# Altium schematic sheet AFE.SchDoc: Plant - AFE
size A4; Author: Carlos de la Fuente; CompanyName: ekuore; DrawnBy: Carlos de la Fuente; Engineer: Carlos de la Fuente; Organization: eKuore; Revision: 0.2; SheetNumber: 4; SheetTotal: 5
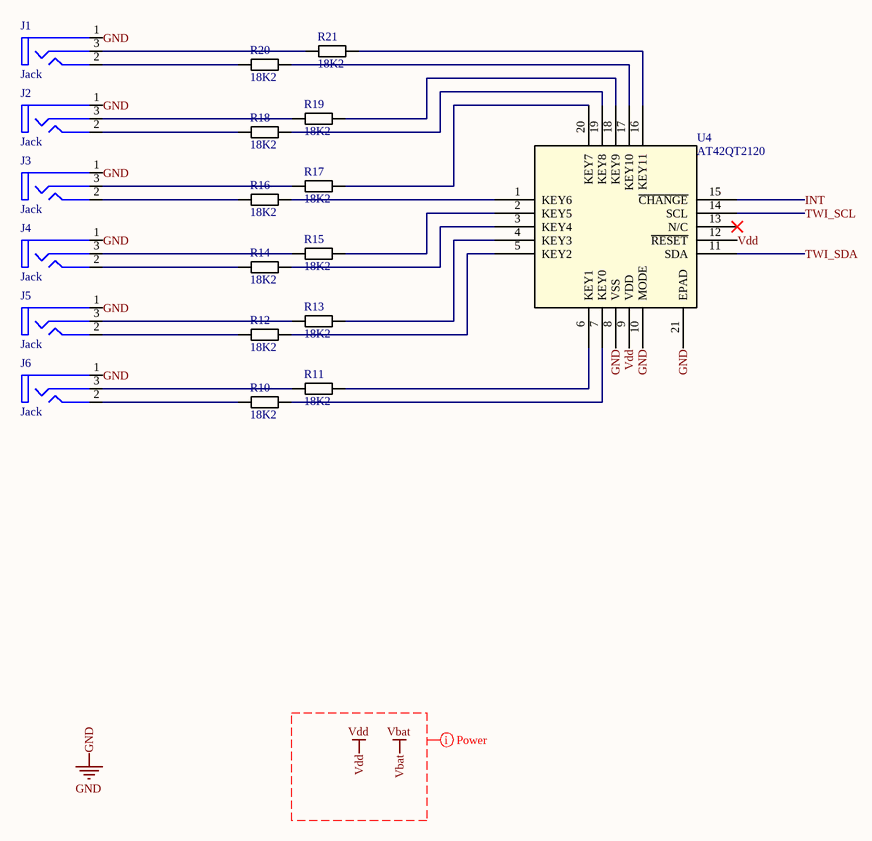
[diagram p0: AFE.SchDoc]

## Parts
J1  Jack  [CUI INC SJ2-2510XA]
J2  Jack  [CUI INC SJ2-2510XA]
J3  Jack  [CUI INC SJ2-2510XA]
J4  Jack  [CUI INC SJ2-2510XA]
J5  Jack  [CUI INC SJ2-2510XA]
J6  Jack  [CUI INC SJ2-2510XA]
R10  18K2  [RES 0402/1005]
R11  18K2  [RES 0402/1005]
R12  18K2  [RES 0402/1005]
R13  18K2  [RES 0402/1005]
R14  18K2  [RES 0402/1005]
R15  18K2  [RES 0402/1005]
R16  18K2  [RES 0402/1005]
R17  18K2  [RES 0402/1005]
R18  18K2  [RES 0402/1005]
R19  18K2  [RES 0402/1005]
R20  18K2  [RES 0402/1005]
R21  18K2  [RES 0402/1005]
U4  AT42QT2120  [MICROCHIP VQFN-20]

## Nets
GND: J1.1(Sleeve) J2.1(Sleeve) J3.1(Sleeve) J4.1(Sleeve) J5.1(Sleeve) J6.1(Sleeve) U4.8(VSS) U4.10(MODE) U4.21(EPAD)
Vdd: U4.9(VDD) U4.12(~{RESET})
INT: U4.15(~{CHANGE})
TWI_SCL: U4.14(SCL)
TWI_SDA: U4.11(SDA)
NetJ1_2: J1.2(Tip) R20.1
NetJ1_3: J1.3(Ring) R21.1
NetJ2_2: J2.2(Tip) R18.1
NetJ2_3: J2.3(Ring) R19.1
NetJ3_2: J3.2(Tip) R16.1
NetJ3_3: J3.3(Ring) R17.1
NetJ4_2: J4.2(Tip) R14.1
NetJ4_3: J4.3(Ring) R15.1
NetJ5_2: J5.2(Tip) R12.1
NetJ5_3: J5.3(Ring) R13.1
NetJ6_2: J6.2(Tip) R10.1
NetJ6_3: J6.3(Ring) R11.1
NetR10_2: R10.2 U4.7(KEY0)
NetR11_2: R11.2 U4.6(KEY1)
NetR12_2: R12.2 U4.5(KEY2)
NetR13_2: R13.2 U4.4(KEY3)
NetR14_2: R14.2 U4.3(KEY4)
NetR15_2: R15.2 U4.2(KEY5)
NetR16_2: R16.2 U4.1(KEY6)
NetR17_2: R17.2 U4.20(KEY7)
NetR18_2: R18.2 U4.19(KEY8)
NetR19_2: R19.2 U4.18(KEY9)
NetR20_2: R20.2 U4.17(KEY10)
NetR21_2: R21.2 U4.16(KEY11)

Not connected (* = marked no-connect by the designer): U4 13(N/C)*

## Layout directives
net class Power: Vbat, Vdd

## Notes on the sheet
- Title
- Size:
- Date:
- A4
- Project:
- Time:
- Sheet
- Drawn By:
- Revision:
- of
- File:

## Library data of the parts
J1-J6 = SJ2-25103A-SMT-TR: CONN JACK STEREO 2.5MM SMD R/A; Manufacturer: CUI; Current Rating: 1A; Gender: Female; Shielding: Unshielded; Number of Conductors: 3; Number of Ports: 1; Part Number: SJ2-25103A-SMT-TR; Value: Jack; Creation Date: 14/07/2021; Revision Date: 14/07/2021; Supplier 1: Digi-Key; Supplier Part Number 1: CP-SJ2-25103A-SMT-CT-ND; Stock 1: 972; RoHS: Yes; Mount: Surface Mount; Contact Material: Copper Alloy; Packaging: Tape and Reel; ComponentLink1URL: https://www.cui.com/product/resource/digikeypdf/sj2-2510x-smt.pdf?src-supplier=Digi-Key; ComponentLink1Description: https://www.cui.com/product/resource/digikeypdf/sj2-2510x-smt.pdf?src-supplier=Digi-Key; Contact Plating: Silver; Color: Black; Housing Material: Nylon; Min Operating Temperature: -25°C; Max Operating Temperature: 85°C; Termination: Solder; Connector Type: Jack; Orientation: Horizontal; Manufacturer 1: CUI; Manufacturer Part Number 1: SJ2-25103A-SMT-TR
R10-R21 = RC0402FR-0718K2L: RES 0402 18K2 1%  63mW; Manufacturer: Yageo; Note: recommended; Temperature Coefficient: 100ppm/°C; Resistance: 18.2kR; Voltage Rating (DC): 50V; Power Rating: 62.5mW; Value: 18K2; Part Number: RC0402FR-0718K2L; Creation Date: 02/07/2019; Revision Date: 02/07/2019; Supplier 1: Digi-Key; Supplier Part Number 1: YAG2371CT-ND; Manufacturer Part Number: RC0402FR-0718K2L; Stock 1: 493024; Pricing 1: 1=0,10000, 10=0,01600, 100=0,00670, 1000=0,00301, 2500=0,00261, 5000=0,00215 (USD); RoHS: Yes; Case/Package: 0402; Min Operating Temperature: -55°C; Max Operating Temperature: 155°C; Tolerance: 1%; Packaging: Tape and Reel; Length: 1mm; Height: 0.016inch; Width: 0.02inch; Depth: 0.5mm; ComponentLink1URL: https://datasheet.ciiva.com/16741/pyu-rc0402-51-rohs-l-6-r-16741879.pdf?src-supplier=Future+Electronics; ComponentLink1Description: https://datasheet.ciiva.com/16741/pyu-rc0402-51-rohs-l-6-r-16741879.pdf?src-supplier=Future+Electronics; Case Code (Imperial): 0402; Case Code (Metric): 1005; Voltage Rating: 50V; Package Quantity: 10000; Termination: SMD/SMT; Composition: Thick Film; Number of Terminations: 2; Military Standard: Not; Max Power Dissipation: 63mW; Features: Moisture Resistant; Radiation Hardening: No; ComponentLink2URL: https://datasheet.ciiva.com/2552/pyu-r-int-thick-7; ComponentLink2Description: https://datasheet.ciiva.com/2552/pyu-r-int-thick-7; ComponentLink3URL: https://datasheet.ciiva.com/5596/pyu-rc0402-51-roh; ComponentLink3Description: https://datasheet.ciiva.com/5596/pyu-rc0402-51-roh; ComponentLink4URL: https://datasheet.ciiva.com/16869/pyu-rc0402-51-ro; ComponentLink4Description: https://datasheet.ciiva.com/16869/pyu-rc0402-51-ro; ComponentLink5URL: https://datasheet.ciiva.com/28403/pyu-rc0402-51-ro; ComponentLink5Description: https://datasheet.ciiva.com/28403/pyu-rc0402-51-ro; Working Voltage: 50V; Contact Plating: Tin
U4 = AT42QT2120-MMHR: IC TOUCH SENSOR 12CH 20VQFN; Manufacturer: Microchip; Manufacturer 1: Microchip / Atmel; Interface: I2C; Number of Channels: 12; Part Number: AT42QT2120-MMHR; Value: AT42QT2120; Revision Date: 21/07/2021; Creation Date: 21/07/2021; Supplier 1: Digi-Key; Supplier Part Number 1: AT42QT2120-MMHRCT-ND; Manufacturer Part Number: AT42QT2120-MMHR; Stock 1: 1727; ComponentLink1URL: https://datasheet.ciiva.com/6483/doc9634-6483533.pdf?src-supplier=Digi-Key; ComponentLink1Description: https://datasheet.ciiva.com/6483/doc9634-6483533.pdf?src-supplier=Digi-Key; RoHS: Yes; Manufacturer Part Number 1: AT42QT2120-MMHR; Case/Package: VQFN; Min Operating Temperature: -40°C; Max Operating Temperature: 85°C; Packaging: Tape and Reel; ComponentLink2URL: https://datasheet.ciiva.com/6483/doc9634-6483527.p; ComponentLink2Description: https://datasheet.ciiva.com/6483/doc9634-6483527.p; ComponentLink3URL: https://datasheet.ciiva.com/6483/doc9634-6483530.p; ComponentLink3Description: https://datasheet.ciiva.com/6483/doc9634-6483530.p; Package Quantity: 1; Series: QTouch™; RoHS Compliant: Yes